# EAGLE design uarthid (EAGLE 6.5.0)
DATABASE: ../../control-surface/pcb/partsdb.txt
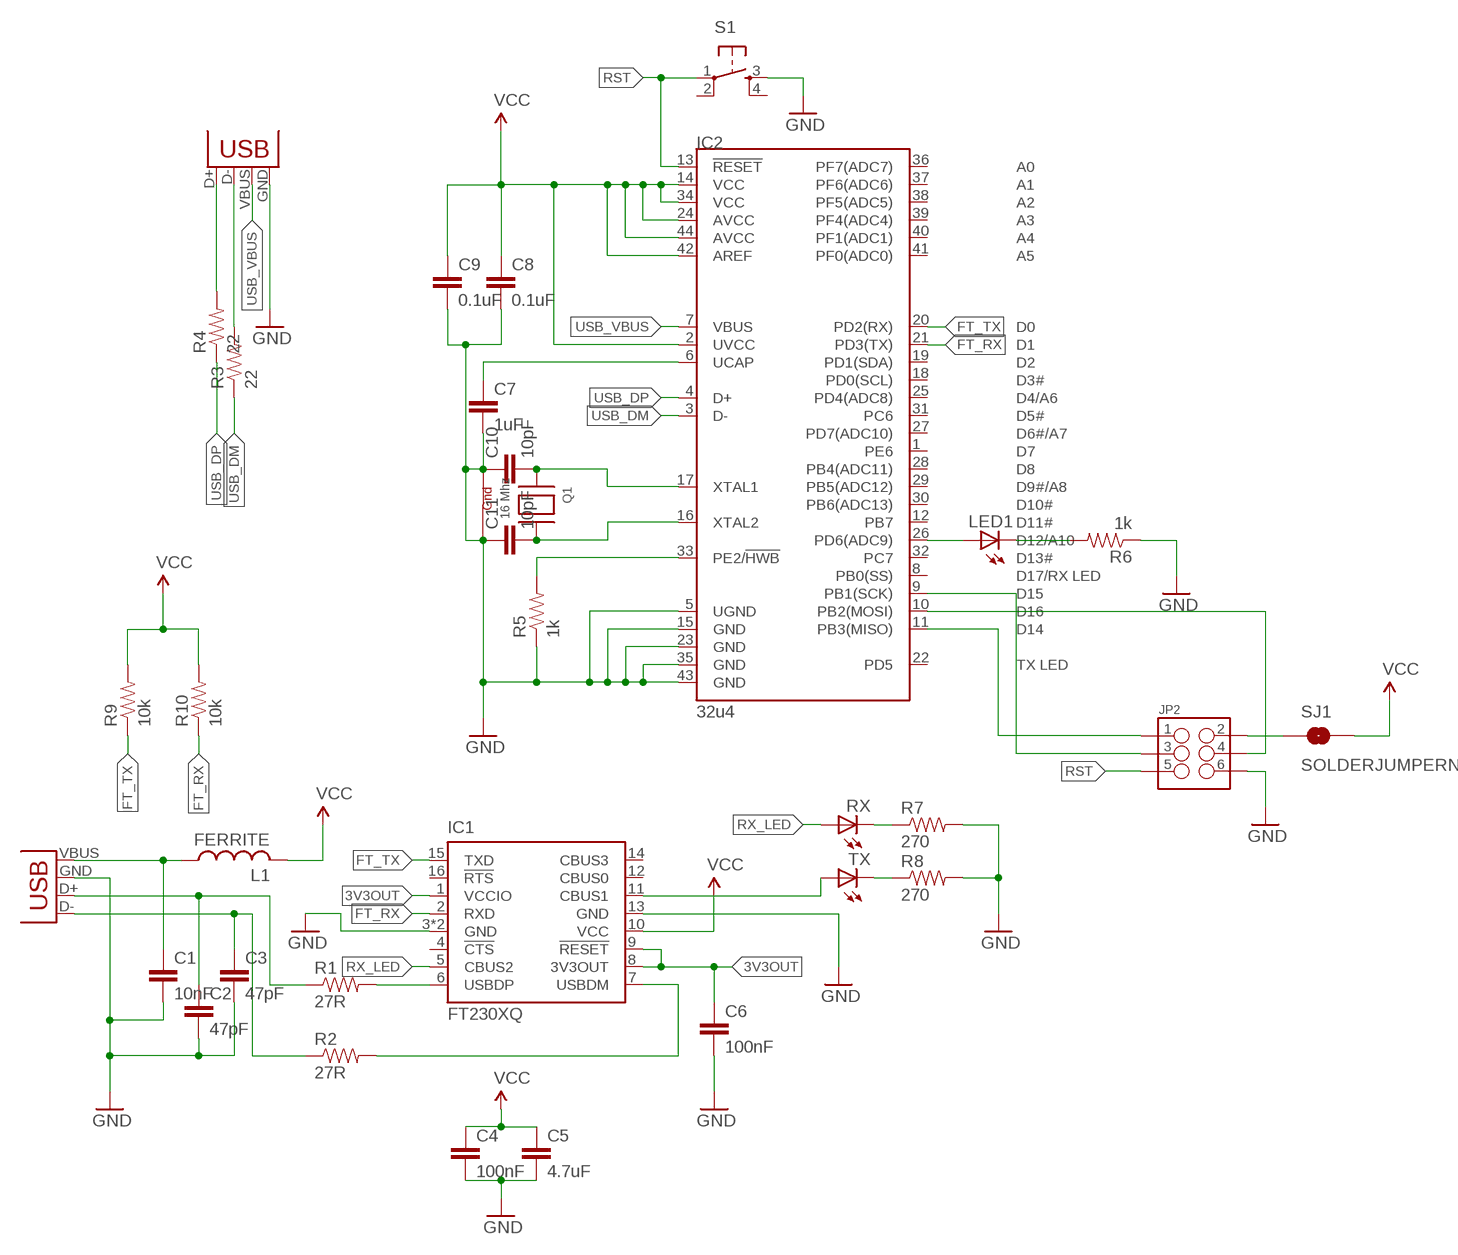
[diagram p0: schematic, sheet 1]

## Parts
C1  10nF  CAP0805  [0805]
C2  47pF  CAP0805  [0805]
C3  47pF  CAP0805  [0805]
C4  100nF  CAP0805  [0805]
C5  4.7uF  CAP0805  [0805]
C6  100nF  CAP0805  [0805]
C7  1uF  CAP0805  [0805]
C8  0.1uF  CAP0805  [0805]
C9  0.1uF  CAP0805  [0805]
C10  10pF  CAP0805  [0805]
C11  10pF  CAP0805  [0805]
IC1  FT230XQ  [QFN16]
IC2  32u4  ATMEGA32U4QFN  [SPARKFUN-DIGITALIC_QFN-44]
JP1  USB-A-H  [USB-A-H]
JP2  M03X22X3_SILK_SM  [2X3]
JP3  USBSMD  [USB-MINIB]
L1  FERRITE  [0805]
LED1  LEDCHIPLED_0805  [CHIPLED_0805]
Q1  16 Mhz  XTAL-4-3225  [NX3225]
R1  27R  RESISTOR0805-RES  [0805]
R2  27R  RESISTOR0805-RES  [0805]
R3  22  RESISTOR0805-RES  [0805]
R4  22  RESISTOR0805-RES  [0805]
R5  1k  RESISTOR0805-RES  [0805]
R6  1k  RESISTOR0805-RES  [0805]
R7  270  RESISTOR0805-RES  [0805]
R8  270  RESISTOR0805-RES  [0805]
R9  10k  RESISTOR0805-RES  [0805]
R10  10k  RESISTOR0805-RES  [0805]
RX  LEDCHIPLED_0805  [CHIPLED_0805]
S1  TAC_SWITCHSMD  [TACTILE_SWITCH_SMD]
SJ1  SOLDERJUMPERNO  [SJ_2S-NO]
TX  LEDCHIPLED_0805  [CHIPLED_0805]

## Nets
3V3OUT: C6.1 IC1.1(VCCIO) IC1.8(3V3OUT) IC1.9(!RESET)
FT_RX: IC1.2(RXD) IC2.21(PD3(TX)) R10.1
FT_TX: IC1.15(TXD) IC2.20(PD2(RX)) R9.1
GND: C1.2 C2.2 C3.2 C4.2 C5.2 C6.2 C7.2 C8.2 C9.2 C10.1 C11.1 IC1.3(GND) IC1.13(GND) IC1.TAB(GND) IC2.5(UGND) IC2.15(GND) IC2.23(GND) IC2.35(GND) IC2.43(GND) JP1.GND(VBUS) JP2.6 JP3.GND Q1.2(G2) Q1.4(G1) R5.1 R6.1 R7.2 R8.2 S1.3
N$1: C2.1 JP1.D+(D-) R1.1
N$2: IC1.6(USBDP) R1.2
N$3: C3.1 JP1.D-(D+) R2.1
N$4: IC1.7(USBDM) R2.2
N$5: C1.1 JP1.VBUS(GND) L1.1
N$6: C10.2 IC2.17(XTAL1) Q1.1(X1)
N$7: C11.2 IC2.16(XTAL2) Q1.3(X2)
N$8: JP3.D- R3.2
N$9: JP3.D+ R4.2
N$10: JP2.2 SJ1.1
N$11: C7.1 IC2.6(UCAP)
N$12: IC2.11(PB3(MISO)) JP2.1
N$13: IC2.9(PB1(SCK)) JP2.3
N$14: IC2.10(PB2(MOSI)) JP2.4
N$15: IC2.33(PE2/!HWB) R5.2
N$16: IC2.26(PD6(ADC9)) LED1.A
N$17: LED1.C R6.2
N$18: IC1.11(CBUS1) TX.A
N$19: R7.1 RX.C
N$20: R8.1 TX.C
RST: IC2.13(!RESET) JP2.5 S1.1
RX_LED: IC1.5(CBUS2) RX.A
USB_DM: IC2.3(D-) R3.1
USB_DP: IC2.4(D+) R4.1
USB_VBUS: IC2.7(VBUS) JP3.VBUS
VCC: C4.1 C5.1 C8.1 C9.1 IC1.10(VCC) IC2.2(UVCC) IC2.14(VCC) IC2.24(AVCC) IC2.34(VCC) IC2.42(AREF) IC2.44(AVCC) L1.2 R9.2 R10.2 SJ1.2
Unconnected: IC1.4(!CTS) IC1.12(CBUS0) IC1.14(CBUS3) IC1.16(!RTS) IC2.1(PE6) IC2.8(PB0(SS)) IC2.12(PB7) IC2.18(PD0(SCL)) IC2.19(PD1(SDA)) IC2.22(PD5) IC2.25(PD4(ADC8)) IC2.27(PD7(ADC10)) IC2.28(PB4(ADC11)) IC2.29(PB5(ADC12)) IC2.30(PB6(ADC13)) IC2.31(PC6) IC2.32(PC7) IC2.36(PF7(ADC7)) IC2.37(PF6(ADC6)) IC2.38(PF5(ADC5)) IC2.39(PF4(ADC4)) IC2.40(PF1(ADC1)) IC2.41(PF0(ADC0)) S1.2 S1.4

## Library data of the parts
C1-C11 = SparkFun-Capacitors:CAP: Capacitor Standard 0603 ceramic capacitor, and 0.1" leaded capacitor.
IC1 = ftdichip:FT230X: USB to BASIC UART IC Auto generated by make-symbol-device-package-bsdl.ulp Rev. 43 Source: Data sheet <http://www.ftdichip.com/Support/Documents/DataSheets/ICs/DS_FT230X.pdf>; PARTNO: FT230XQ-T
IC2 = SparkFun-DigitalIC:ATMEGA32U4: Atmel 44-pin 8-bit Microcontroller with 32KBytes of ISP Flash and USB Controller ----- Please use the QFN-44-NOPAD_1:1 package for the footprint of all boards using a 32U4. Route traces directly away from the pads as much as possible.; PARTNO: ATMEGA32U4RC-MU
JP1 = SparkFun-Connectors:USB: USB Connectors USB-B-PTH is fully proven SKU : PRT-00139/CONN-08278 USB-miniB is fully proven SKU : PRT-00587 USB-A-PCB is untested. USB-A-H is throughly reviewed, but untested. Spark Fun Electronics SKU : PRT-00437 USB-B-SMT is throughly reviewed, but untested. Needs silkscreen touching up. USB-A-S has not been used/tested USB-MB-H has not been used/tested USB-MICROB has been used. CONN-09505; PARTNO: 1002-015-01001
JP2 = SparkFun-Connectors:M03X2: 2x3 .1" header. Shrouded, with keying- CONN-10681 SMT- CONN-11415 Pogo pins- HW-11044
JP3 = SparkFun-Connectors:USB: USB Connectors USB-B-PTH is fully proven SKU : PRT-00139/CONN-08278 USB-miniB is fully proven SKU : PRT-00587 USB-A-PCB is untested. USB-A-H is throughly reviewed, but untested. Spark Fun Electronics SKU : PRT-00437 USB-B-SMT is throughly reviewed, but untested. Needs silkscreen touching up. USB-A-S has not been used/tested USB-MB-H has not been used/tested USB-MICROB has been used. CONN-09505; PARTNO: 690-005-299-043
L1 = Livestream:FERRITE; PARTNO: CIM21J601NE
LED1 RX TX = adafruit:LED: LED OSRAM: - CHIPLED LG R971, LG N971, LY N971, LG Q971, LY Q971, LO R971, LY R971 LH N974, LH R974 LS Q976, LO Q976, LY Q976 LO Q996 - Hyper CHIPLED LW Q18S LB Q993, LB Q99A, LB R99A - SideLED LS A670, LO A670, LY A670, LG A670, LP A670 LB A673, LV A673, LT A673, LW A673 LH A674 LY A675 LS A676, LA A676, LO A676, LY A676, LW A676 LS A679, LY A679, LG A679 - Hyper Micro SIDELED® LS Y876, LA Y876, LO Y876, LY Y876 LT Y87S - SmartLED LW L88C, LW L88S LB L89C, LB L89S, LG L890 LS L89K, LO L89K, LY L89K LS L896, LA L896, LO L896, LY L896 - TOPLED LS T670, LO T670, LY T670, LG T670, LP T670 LSG T670, LSP T670, LSY T670, LOP T670, LYG T670 LG T671, LOG T671, LSG T671 LB T673, LV T673, LT T673, LW T673 LH T674 LS T676, LA T676, LO T676, LY T676, LB T676, LH T676, LSB T676, LW T676 LB T67C, LV T67C, LT T67C, LS T67K, LO T67K, LY T67K, LW E67C LS E67B, LA E67B, LO E67B, LY E67B, LB E67C, LV E67C, LT E67C LW T67C LS T679, LY T679, LG T679 LS T770, LO T770, LY T770, LG T770, LP T770 LB T773, LV T773, LT T773, LW T773 LH T774 LS E675, LA E675, LY E675, LS T675 LS T776, LA T776, LO T776, LY T776, LB T776 LHGB T686 LT T68C, LB T68C - Hyper Mini TOPLED® LB M676 - Mini TOPLED Santana® LG M470 LS M47K, LO M47K, LY M47K Source: http://www.osram.convergy.de/
Q1 = adafruit:XTAL-4: Classic 4-pin 3.2 x 2.5mm crystal; PARTNO: TSX-3225 16.0000MF18X-AC3
R1-R10 = SparkFun-Passives:RESISTOR: Resistor Basic schematic elements and footprints for 0603, 1206, and PTH resistors.
S1 = SparkFun-Electromechanical:TAC_SWITCH: Momentary Switch Button commonly used for reset or general input. Spark Fun Electronics SKU : COM-00097 SMT- SWCH-08247; PROD_ID: SWCH-08247
SJ1 = SparkFun-Passives:SOLDERJUMPER: Solder Jumper Standard SMD solder jumper. Used to automate production. Two varients : Normally Open and Normally Closed are the same, but have different paste layers. NC will have a large amount of paste and should jumper during reflow.

## Net classes
0 default: width 0.152 mm, drill 0.33 mm, clearance 0.152 mm

## Board
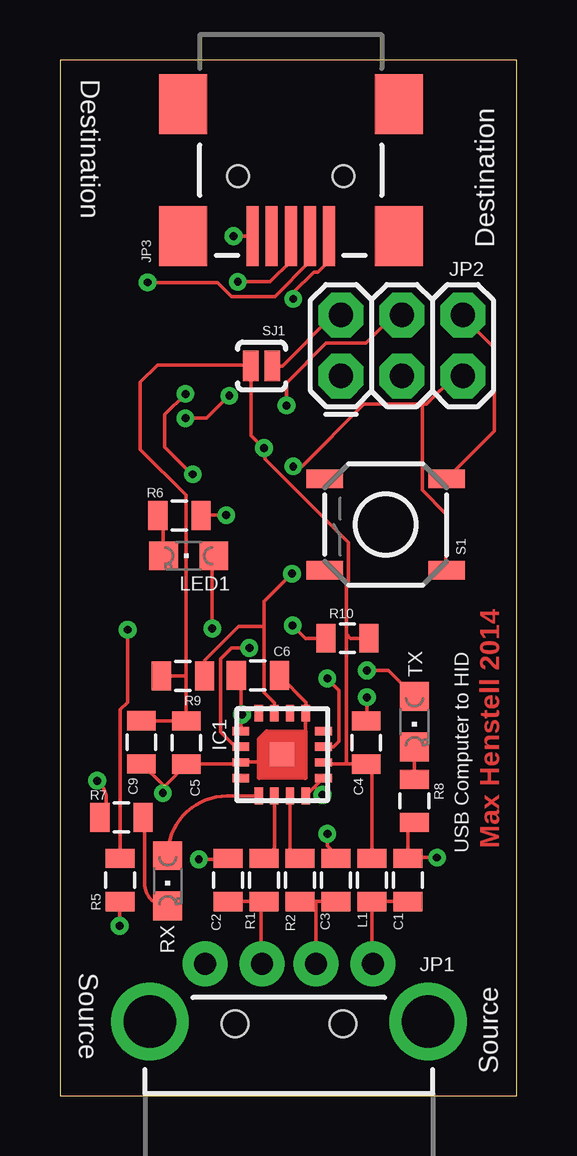
[diagram p1: board, top side]
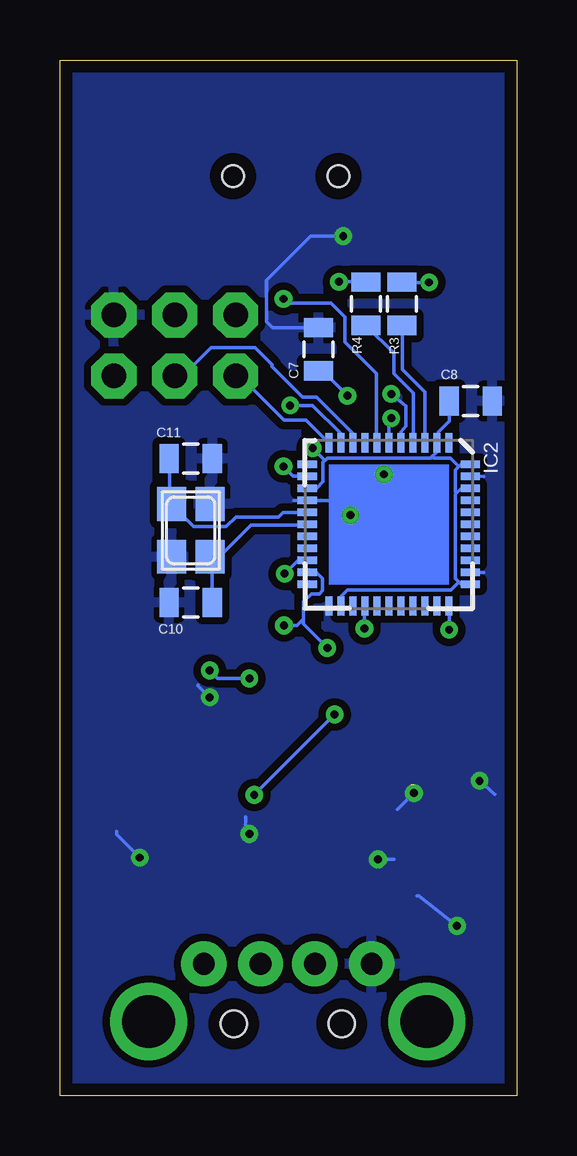
[diagram p2: board, bottom side, seen from below]

Size 19.05 x 43.18 mm. Coordinates in mm from the lower left corner, seen from the top.
Outline: 0,0 19.05,0 19.05,43.18 0,43.18 0,0
Copper layers (1*16): Top 0.035mm / dielectric 1.5mm / Bottom 0.035mm
Design rules "default *": minimum track width 6mil, minimum drill 13mil, track to track 6mil, track to pad 6mil, pad to pad 6mil, via to via 6mil, smd to smd 6mil, copper to edge 20mil, drill to drill 6mil, minimum pad ring 10mil, minimum via ring 8mil, stop-mask expansion 4mil, vias tented up to drill 0mil, thermal gap 10mil

### Footprints (pad centres in the part's own frame; a part is rotated, then mirrored left to right if it is on the bottom)
0805 = smd 0.8 x 1.2: 1 -0.9,0; 2 0.9,0
QFN16 = smd 0.7 x 0.35: 1 -1.725,0.975; 2 -1.725,0.325; 3 -1.725,-0.325; 4 -1.725,-0.975; 9 1.725,-0.975; 10 1.725,-0.325; 11 1.725,0.325; 12 1.725,0.975 | smd 0.35 x 0.7: 5 -0.975,-1.725; 6 -0.325,-1.725; 7 0.325,-1.725; 8 0.975,-1.725; 13 0.975,1.725; 14 0.325,1.725; 15 -0.325,1.725; 16 -0.975,1.725 | smd 1 x 1: TAB 0,0
SPARKFUN-DIGITALIC_QFN-44 = smd 0.8 x 0.3: 1 -3.4,2.5; 2 -3.4,2; 3 -3.4,1.5; 4 -3.4,1; 5 -3.4,0.5; 6 -3.4,0; 7 -3.4,-0.5; 8 -3.4,-1; 9 -3.4,-1.5; 10 -3.4,-2; 11 -3.4,-2.5; 23 3.4,-2.5; 24 3.4,-2; 25 3.4,-1.5; 26 3.4,-1; 27 3.4,-0.5; 28 3.4,0; 29 3.4,0.5; 30 3.4,1; 31 3.4,1.5; 32 3.4,2; 33 3.4,2.5 | smd 0.3 x 0.8: 12 -2.5,-3.4; 13 -2,-3.4; 14 -1.5,-3.4; 15 -1,-3.4; 16 -0.5,-3.4; 17 0,-3.4; 18 0.5,-3.4; 19 1,-3.4; 20 1.5,-3.4; 21 2,-3.4; 22 2.5,-3.4; 34 2.5,3.4; 35 2,3.4; 36 1.5,3.4; 37 1,3.4; 38 0.5,3.4; 39 0,3.4; 40 -0.5,3.4; 41 -1,3.4; 42 -1.5,3.4; 43 -2,3.4; 44 -2.5,3.4
USB-A-H = drill 0.914 pad 1.88: D+ 2.4,1.127; D- 2.4,-1.127; GND 2.4,3.5; VBUS 2.4,-3.5 | drill 2.2: GND2 0,-5.8; GND3 0,5.8 | hole 1.1: -0.1,2.25; -0.1,-2.25
2X3 = drill 1.016 pad 1.88 octagon: 1 0,0; 2 0,2.54; 3 2.54,0; 4 2.54,2.54; 5 5.08,0; 6 5.08,2.54
USB-MINIB = smd 2.5 x 0.5: D+ 2.5,0; D- 2.5,0.8; GND 2.5,-1.6; ID 2.5,-0.8; VBUS 2.5,1.6 | smd 2.5 x 2: MTN1 -3,4.5; MTN2 2.5,4.5; MTN3 -3,-4.5; MTN4 2.5,-4.5 | hole 0.9: 0,2.2; 0,-2.2
CHIPLED_0805 = smd 1.2 x 1.2: A 0,-1.05; C 0,1.05
NX3225 = smd 1.4 x 1.2: 1 -1.1,-0.8; 2 1.1,-0.8; 3 1.1,0.8; 4 -1.1,0.8
TACTILE_SWITCH_SMD = smd 1.524 x 0.762: 1 -2.54,1.905; 2 2.54,1.905; 3 -2.54,-1.905; 4 2.54,-1.905
SJ_2S-NO = smd 0.635 x 1.27: 1 -0.45,0; 2 0.45,0

### Placement (x,y rotation side)
C1  14.51,9 90 top
C2  7.01,9 90 top
C3  11.51,9 90 top
C4  12.77,14.72 90 top
C5  5.27,14.72 270 top
C6  8.25,17.52 0 top
C7  8.27,31.12 90 bottom
C8  1.92,28.96 0 bottom
C9  3.39,14.74 270 top
C10  13.59,20.57 0 bottom
C11  13.59,26.57 180 bottom
IC1  9.27,14.22 0 top
IC2  5.33,23.82 270 bottom
JP1  9.55,3.1 90 top
JP2  11.72,30.01 0 top
JP3  9.63,38.33 270 top
L1  13.01,9 90 top
LED1  5.37,22.51 90 top
Q1  13.59,23.57 90 bottom
R1  8.51,9 90 top
R2  10.01,9 90 top
R3  4.79,33.02 90 bottom
R4  6.29,33.02 90 bottom
R5  2.51,9 90 top
R6  4.99,24.18 180 top
R7  2.57,11.61 180 top
R8  14.78,12.29 270 top
R9  5.13,17.5 180 top
R10  11.99,19.08 0 top
RX  4.5,8.97 180 top
S1  13.58,23.81 180 top
SJ1  8.41,30.42 180 top
TX  14.78,15.6 180 top

### Tracks (layer width: path | path; a pad name or v marks a point on that pad's centre or on a via)
3V3OUT  (via drill 0.33)
  Top 0.152: 10.62,12.88 10.97,13.23 IC1.9 | 10.62,12.88 10.26,12.52 IC1.8 | 7.54,15.9 7.54,17.32 7.37,17.5 C6.1 | 7.54,15.9 7.54,15.21 IC1.1 | v10.95,12.55 10.62,12.88 | v7.59,15.9 7.54,15.9
  Bottom 0.152: v7.59,15.9 v10.95,12.55
FT_RX  (via drill 0.33)
  Top 0.152: v7.9,18.67 7.16,18.67 6.71,18.21 6.71,15.16 7.32,14.55 IC1.2 | R10.1 10.24,19.07 v9.7,19.61
  Bottom 0.152: v7.9,18.67 8.89,19.66 8.89,19.89 | 8.89,19.89 8.89,20.6 8.56,20.93 8.23,20.93 8.1,21.06 8.1,21.57 8.36,21.82 8.71,21.82 IC2.21 | v9.7,19.61 9.17,19.61 8.89,19.89
FT_TX  (via drill 0.33)
  Top 0.152: 8.51,19.58 8.51,20.6 v9.68,21.77 | 8.51,19.58 8.51,16.82 8.94,16.38 IC1.15 | R9.1 6.03,18.15 7.44,19.56 8.48,19.56 8.51,19.58
  Bottom 0.152: v9.68,21.77 9.14,22.3 8.74,22.3 IC2.20
GND  (via drill 0.33)  (1 unrouted)
  Top 0.152: 10.26,15.95 IC1.13 | IC1.13 10.26,16.03 10.26,16.41 9.17,17.5 C6.2 | C5.2 5.28,13.84 7.49,13.84 IC1.3 7.57,13.92 8.97,13.92 9.25,14.2 IC1.TAB 9.32,14.28 10.24,15.19 10.24,15.88 IC1.13 | C9.2 3.4,13.84 4.29,12.95 v4.29,12.62 | 5.21,13.84 C5.2 | 5.87,24.18 R6.1 5.91,24.21 v6.93,24.21 | 14.5,9.88 C1.2 | C4.2 12.8,15.65 v12.8,16.61 | C1.2 14.48,9.96 14.5,9.93 v15.72,9.93 | R5.1 2.52,8.08 2.9,8.08 2.49,8 v2.49,7.09 | 6.99,9.88 C2.2 | S1.3 18.11,27.71 18.11,31.17 16.8,32.48 JP2.6 | v7.24,35.84 JP3.GND | 11.46,9.86 C3.2 11.53,9.88 11.68,9.88 11.15,10.41 v11.15,10.92 | 6.96,9.96 C2.2 | C5.2 4.42,12.97 4.42,12.68 | v5.23,29.26 4.37,28.4 4.37,27.05 5.51,25.91 v5.54,25.91 | C2.2 6.96,9.86 v5.79,9.86 | R8.2 14.51,11.12 C1.2 | R7.2 1.73,11.73 arc90 v1.55,13.13
  Bottom 0.152: IC2.35 1.57,21.82 1.38,21.82 | IC2.43 1.93,25.83 1.57,25.83 1.38,25.82 | 4.85,27.58 4.85,27.23 IC2.5 4.83,27.68 4.62,27.91 4.62,28.75 v5.23,29.26 | 9.29,24.82 9.09,24.82 IC2.15 6.91,24.82 | v4.29,12.62 4.98,11.94 | v6.93,24.21 6.91,24.23 6.91,24.82 | 6.91,24.82 6.91,25.4 6.45,25.86 5.59,25.86 v5.54,25.91 | C7.2 8.28,32.03 10.19,32.03 10.44,32.28 10.44,34.01 8.61,35.84 v7.24,35.84 | v2.49,7.09 4.09,8.33 4.17,8.33 | v5.79,9.86 5.13,9.86 | v11.15,10.92 11.3,11.07 11.3,11.63 | v15.72,9.93 16.69,10.9 16.69,11.02 | v12.8,16.61 13.28,17.09 13.28,17.12 | v1.55,13.13 0.91,12.57
  pour Bottom (isolate 0.305): 0.63,43.4 18.64,43.3 18.69,0.05 0.5,0
N$1
  Top 0.152: C2.1 8.48,8.1 R1.1 8.38,8.05 8.38,5.51 JP1.D+
N$2
  Top 0.152: IC1.6 8.94,10.34 R1.2
N$3
  Top 0.152: 10.67,8.1 C3.1 | 10.67,8.1 10.03,8.1 R2.1 | 10.67,8.1 10.67,5.64 JP1.D-
N$4
  Top 0.152: IC1.7 9.6,12.5 9.6,10.31 R2.2
N$5
  Top 0.152: C1.1 13.03,8.1 L1.1 13.01,8.03 13.01,5.64 JP1.VBUS
N$6
  Bottom 0.152: IC2.17 8.74,23.8 11.07,23.8 12.39,22.48 12.78,22.48 Q1.1 12.7,22.43 C10.2
N$7
  Bottom 0.152: IC2.16 8.74,24.31 9.75,24.31 9.93,24.13 11.71,24.13 12.12,23.72 13.49,23.72 14.38,24.61 14.38,24.66 Q1.3 14.45,24.71 14.48,24.74 14.48,26.57 C11.2
N$8  (via drill 0.33)
  Top 0.152: v3.66,33.91 6.58,33.91 7.16,33.33 8.97,33.33 10.41,34.77 10.41,35.81 JP3.D-
  Bottom 0.152: v3.66,33.91 4.78,33.91 R3.2
N$9  (via drill 0.33)
  Top 0.152: v7.42,33.93 8.76,33.93 9.63,34.8 JP3.D+
  Bottom 0.152: v7.42,33.93 6.3,33.93 R4.2
N$10
  Top 0.152: SJ1.1 9.27,30.43 11.38,32.54 JP2.2
N$11  (via drill 0.33)
  Top 0.152: v5.23,28.25 6.12,28.25 v7.06,29.18
  Bottom 0.152: v5.23,28.25 5.33,28.14 IC2.6 | v7.06,29.18 7.77,29.9 7.77,30.1 C7.1
N$12
  Bottom 0.152: IC2.11 7.85,27.23 8.79,28.17 9.7,28.17 11.38,29.84 11.38,30 JP2.1
N$13
  Bottom 0.152: IC2.9 6.86,27.23 6.86,27.64 8.36,29.13 8.94,29.13 10.21,30.4 10.21,30.48 10.92,31.19 12.75,31.19 13.92,30.02 JP2.3
N$14  (via drill 0.33)
  Top 0.152: v9.45,28.78 9.45,29.72 11.1,31.37 12.75,31.37 13.92,32.54 JP2.4
  Bottom 0.152: v9.45,28.78 8.51,28.78 7.34,27.61 IC2.10
N$15  (via drill 0.33)
  Top 0.152: v2.82,19.43 2.82,16.41 2.52,16.1 R5.2
  Bottom 0.152: v2.82,19.43 2.82,20.42 IC2.33
N$16  (via drill 0.33)
  Top 0.152: v6.35,19.48 6.35,22.45 6.4,22.5 LED1.A
  Bottom 0.152: v6.35,19.48 6.35,20.42 IC2.26
N$17
  Top 0.152: LED1.C 4.29,22.53 4.29,23.98 R6.2
N$18  (via drill 0.33)
  Top 0.152: TX.A 13.7,17.73 v12.8,17.73 | v11.15,17.4 11.63,16.89 11.63,14.78 11.4,14.55 IC1.11
  Bottom 0.152: v12.8,17.73 12.47,17.4 v11.15,17.4
N$19
  Top 0.152: RX.C 4.45,7.92 arc-90 3.53,8.84 3.53,11.54 arc90 R7.1
N$20
  Top 0.152: R8.1 TX.C
RST  (via drill 0.33)
  Top 0.152: v9.73,26.24 10.08,26.24 12.68,28.83 15.11,28.83 | 15.11,28.83 15.29,28.83 16.46,30 JP2.5 | 15.11,28.83 15.11,25.25 16.1,24.26 16.1,21.92 S1.1
  Bottom 0.152: v9.73,26.24 9.32,25.83 8.74,25.83 IC2.13
RX_LED
  Top 0.152: IC1.5 6.98,12.5 arc90 RX.A
USB_DM
  Bottom 0.152: IC2.3 3.83,29.34 4.78,30.28 4.78,32.11 R3.1
USB_DP
  Bottom 0.152: IC2.4 4.32,27.23 4.32,29.29 5.13,30.1 5.13,30.96 R4.1 6.27,32.11
USB_VBUS  (via drill 0.33)
  Top 0.152: JP3.VBUS 11.2,35.81 11.2,34.77 10.77,34.34 10.59,34.34 9.73,33.48 v9.73,33.22
  Bottom 0.152: IC2.7 5.84,27.23 5.84,30.1 7.16,31.42 7.16,32.46 7.75,33.05 9.55,33.05 v9.73,33.22
VCC  (via drill 0.33)
  Top 0.152: IC1.10 11.05,13.84 11.94,13.84 | 11.94,13.84 12.75,13.84 C4.1 12.8,13.77 13.01,13.56 L1.2 | C9.1 3.4,15.62 5.26,15.62 C5.1 5.26,15.7 5.26,17.45 | 5.26,17.45 5.26,25.04 3.35,26.95 3.35,29.74 4.06,30.45 7.92,30.45 SJ1.2 7.98,30.4 7.98,27.53 v8.51,27 8.56,26.95 8.56,26.54 12.04,23.06 12.04,21.44 11.94,21.34 11.94,19.25 | 11.94,19.25 11.94,13.84 | R9.2 5.21,17.5 arc-90 5.26,17.45 | R10.2 12.12,19.07 11.94,19.25
  Bottom 0.152: 2.41,21.41 2.56,21.57 2.56,25.07 2.52,25.12 | 2.41,21.41 2.34,21.34 1.96,21.34 IC2.34 | 2.52,25.12 2.34,25.3 1.96,25.3 IC2.42 | 2.41,21.41 2.74,21.08 7.06,21.08 7.32,20.83 7.32,20.45 IC2.24 | 2.41,26.24 2.56,26.09 2.56,25.17 2.52,25.12 | 2.41,26.24 2.34,26.31 1.96,26.31 IC2.44 | 8,26.49 7.9,26.59 3.58,26.59 3.53,26.64 | 8,26.49 8.08,26.42 8.08,25.6 8.36,25.32 8.71,25.32 IC2.14 | 3.53,26.64 3.35,26.82 3.35,27.2 IC2.2 3.28,27.25 3.28,27.66 2.82,28.12 C8.1 | 8,26.49 v8.51,27 | 2.41,26.24 2.77,26.59 3.48,26.59 3.53,26.64

### Text on the board
Top: Max Henstell 2014
tPlace: Destination | Destination | USB Computer to HID | Source | Source